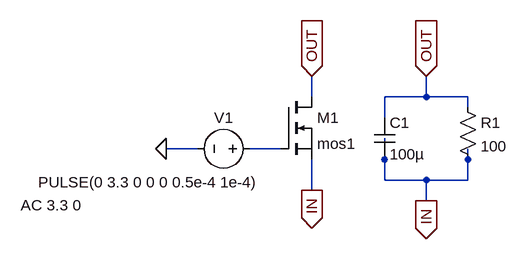
[diagram p0: schematic module-test-circuit-with-load.asc]
module-test-circuit-with-load.asc, the LTspice schematic file:
Version 4
SHEET 1 1492 680
WIRE 384 48 384 16
WIRE 560 48 560 16
WIRE 560 48 496 48
WIRE 624 48 560 48
WIRE 624 64 624 48
WIRE 496 80 496 48
WIRE 208 128 160 128
WIRE 336 128 288 128
WIRE 496 144 496 112
WIRE 624 144 624 128
WIRE 496 176 496 144
WIRE 560 176 496 176
WIRE 624 176 624 144
WIRE 624 176 560 176
WIRE 384 192 384 144
WIRE 560 208 560 176
FLAG 384 16 OUT
IOPIN 384 16 In
FLAG 384 192 IN
IOPIN 384 192 Out
FLAG 160 128 0
FLAG 560 208 IN
IOPIN 560 208 Out
FLAG 560 16 OUT
IOPIN 560 16 In
SYMBOL nmos 336 48 R0
SYMATTR InstName M1
SYMATTR Value mos1
SYMBOL voltage 304 128 R90
WINDOW 0 -32 56 VBottom 2
WINDOW 3 36 171 VTop 2
WINDOW 123 71 321 VTop 2
WINDOW 39 0 0 Left 2
SYMATTR InstName V1
SYMATTR Value PULSE(0 3.3 0 0 0 0.5e-4 1e-4)
SYMATTR Value2 AC 3.3 0
SYMBOL cap 480 80 R0
SYMATTR InstName C1
SYMATTR Value 100µ
SYMBOL res 608 48 R0
SYMATTR InstName R1
SYMATTR Value 100

The netlist it stands for:
* module-test-circuit-with-load.asc
M1 OUT N001 IN IN mos1
V1 N001 0 PULSE(0 3.3 0 0 0 0.5e-4 1e-4) AC 3.3 0
C1 OUT IN 100µ
R1 OUT IN 100
.model NMOS NMOS
.model PMOS PMOS
.lib standard.mos
.backanno
.end